# Altium schematic sheet LSM9DS0.SchDoc
size A4
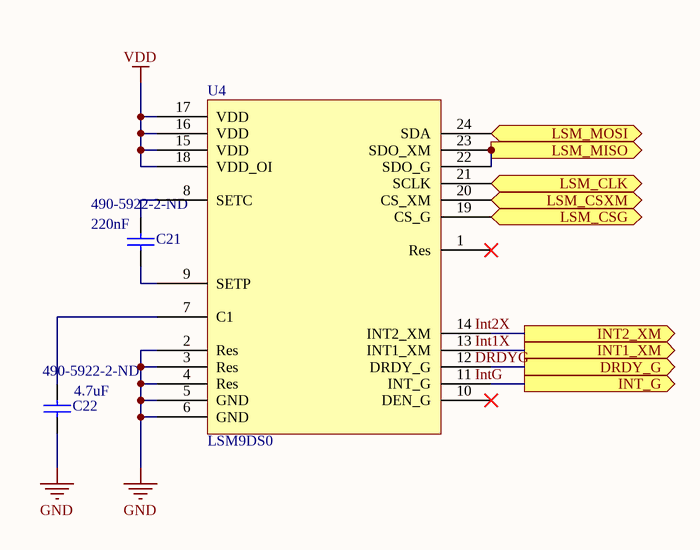
[diagram p0: LSM9DS0.SchDoc]

## Parts
C21  value 220nF  Supplier Part Number 1: 490-5922-2-ND  [0402]  (hidden comment: Cap Semi)
C22  value 4.7uF  Supplier Part Number 1: 490-5922-2-ND  [0402]  (hidden comment: Cap Semi)
U4  Component_1  [PCBComponent_1]  (value not drawn)

## Ports
DRDY_G (out), INT1_XM (out), INT2_XM (out), INT_G (out), LSM_CLK (in), LSM_CSG (in), LSM_CSXM (in), LSM_MISO (out), LSM_MOSI (in)

## Nets
GND: C22.1 U4.2(Res) U4.3(Res) U4.4(Res) U4.5(GND) U4.6(GND)
VDD: U4.15(VDD) U4.16(VDD) U4.17(VDD) U4.18(VDD_OI)
DRDY_G: U4.12(DRDY_G) ; port DRDY_G
INT1_XM: U4.13(INT1_XM) ; port INT1_XM
INT2_XM: U4.14(INT2_XM) ; port INT2_XM
INT_G: U4.11(INT_G) ; port INT_G
LSM_CLK: U4.21(SCLK) ; port LSM_CLK
LSM_CSG: U4.19(CS_G) ; port LSM_CSG
LSM_CSXM: U4.20(CS_XM) ; port LSM_CSXM
LSM_MISO: U4.22(SDO_G) U4.23(SDO_XM) ; port LSM_MISO
LSM_MOSI: U4.24(SDA) ; port LSM_MOSI
NetC21_1: C21.1 U4.9(SETP)
NetC21_2: C21.2 U4.8(SETC)
NetC22_2: C22.2 U4.7(C1)

Not connected (* = marked no-connect by the designer): U4 1(Res)* 10(DEN_G)*

## Notes on the sheet
- Labels drawn without touching a wire or pin: DRDYG, Int1X, Int2X, IntG
- (in symbol Component_1) LSM9DS0

## Library data of the parts
C21 C22 = Cap Semi: Capacitor (Semiconductor SIM Model); Published: 8-Jun-2000; LatestRevisionDate: 29-May-2009; LatestRevisionNote: IPC-7351 Footprint Added.; PackageReference: C1206; Publisher: Altium Limited; PackageDescription: Chip Capacitor; Supplier 1: Digi-Key